# Altium schematic sheet port-expander.SchDoc
size A4
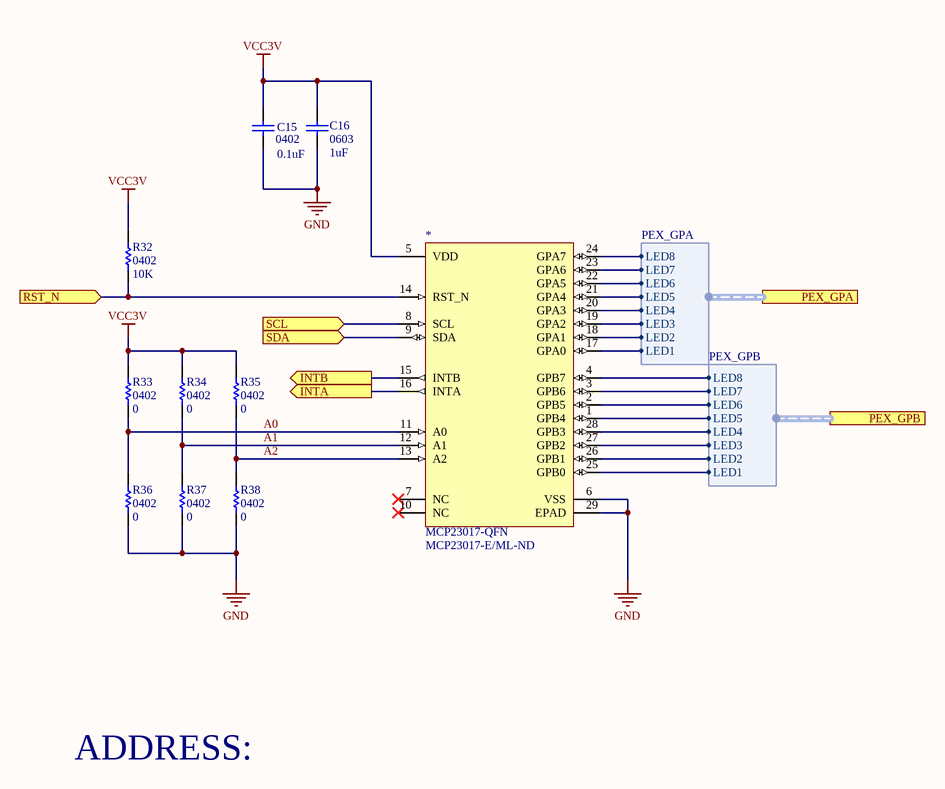
[diagram p0: port-expander.SchDoc]

## Parts
*  MCP23017-QFN  Supplier Part Number 1: MCP23017-E/ML-ND  [QFN65P600X600X100-29]
C15  0402  value 0.1uF  [1608[0603]]
C16  0603  value 1uF  [RAD-0.3]
R32  0402  value 10K  [AXIAL-0.3]
R33  0402  value 0  [AXIAL-0.3]
R34  0402  value 0  [AXIAL-0.3]
R35  0402  value 0  [AXIAL-0.3]
R36  0402  value 0  [AXIAL-0.3]
R37  0402  value 0  [AXIAL-0.3]
R38  0402  value 0  [AXIAL-0.3]

## Ports
INTA (out), INTB (out), PEX_GPA (harness PEX_GPA), PEX_GPB (harness PEX_GPB), RST_N (in), SCL (in), SDA (in)

## Harnesses
PEX_GPA: LED1, LED2, LED3, LED4, LED5, LED6, LED7, LED8
PEX_GPB: LED1, LED2, LED3, LED4, LED5, LED6, LED7, LED8

## Nets
GND: *.6(VSS) *.29(EPAD) C15.1 C16.1 R36.1 R37.1 R38.1
VCC3V: *.5(VDD) C15.2 C16.2 R32.2 R33.2 R34.2 R35.2
A0: *.11(A0) R33.1 R36.2
A1: *.12(A1) R34.1 R37.2
A2: *.13(A2) R35.1 R38.2
INTA: *.16(INTA) ; port INTA
INTB: *.15(INTB) ; port INTB
RST_N: *.14(RST_N) R32.1 ; port RST_N
SCL: *.8(SCL) ; port SCL
SDA: *.9(SDA) ; port SDA
Net*_1: *.1(GPB4) ; port PEX_GPB.LED5
Net*_2: *.2(GPB5) ; port PEX_GPB.LED6
Net*_3: *.3(GPB6) ; port PEX_GPB.LED7
Net*_4: *.4(GPB7) ; port PEX_GPB.LED8
Net*_17: *.17(GPA0) ; port PEX_GPA.LED1
Net*_18: *.18(GPA1) ; port PEX_GPA.LED2
Net*_19: *.19(GPA2) ; port PEX_GPA.LED3
Net*_20: *.20(GPA3) ; port PEX_GPA.LED4
Net*_21: *.21(GPA4) ; port PEX_GPA.LED5
Net*_22: *.22(GPA5) ; port PEX_GPA.LED6
Net*_23: *.23(GPA6) ; port PEX_GPA.LED7
Net*_24: *.24(GPA7) ; port PEX_GPA.LED8
Net*_25: *.25(GPB0) ; port PEX_GPB.LED1
Net*_26: *.26(GPB1) ; port PEX_GPB.LED2
Net*_27: *.27(GPB2) ; port PEX_GPB.LED3
Net*_28: *.28(GPB3) ; port PEX_GPB.LED4

Not connected (* = marked no-connect by the designer): * 7(NC)* 10(NC)*

## Notes on the sheet
- ADDRESS:

## Library data of the parts
C15 = Cap Semi: Capacitor (Semiconductor SIM Model); Published: 8-Jun-2000; LatestRevisionDate: 29-May-2009; LatestRevisionNote: IPC-7351 Footprint Added.; PackageReference: C1206; Publisher: Altium Limited; PackageDescription: Chip Capacitor; Supplier: Digi-Key; Supplier Part Number: 587-3807-1-ND
C16 = Cap: Capacitor; Published: 8-Jun-2000; LatestRevisionDate: 17-Jul-2002; LatestRevisionNote: Re-released for DXP Platform.; PackageReference: RAD-0.3; Publisher: Altium Limited; PackageDescription: Radial Cap, Thru-Hole; 2 Leads; 0.3 in Pin Spacing
R32-R38 = Res1: Resistor; Published: 8-Jun-2000; LatestRevisionDate: 17-Jul-2002; LatestRevisionNote: Re-released for DXP Platform.; PackageReference: AXIAL-0.3; Publisher: Altium Limited; PackageDescription: Axial Device, Thru-Hole; 2 Leads; 0.3 in Pin Spacing
* = MCP23017-QFN: Supplier 1: Digi-Key